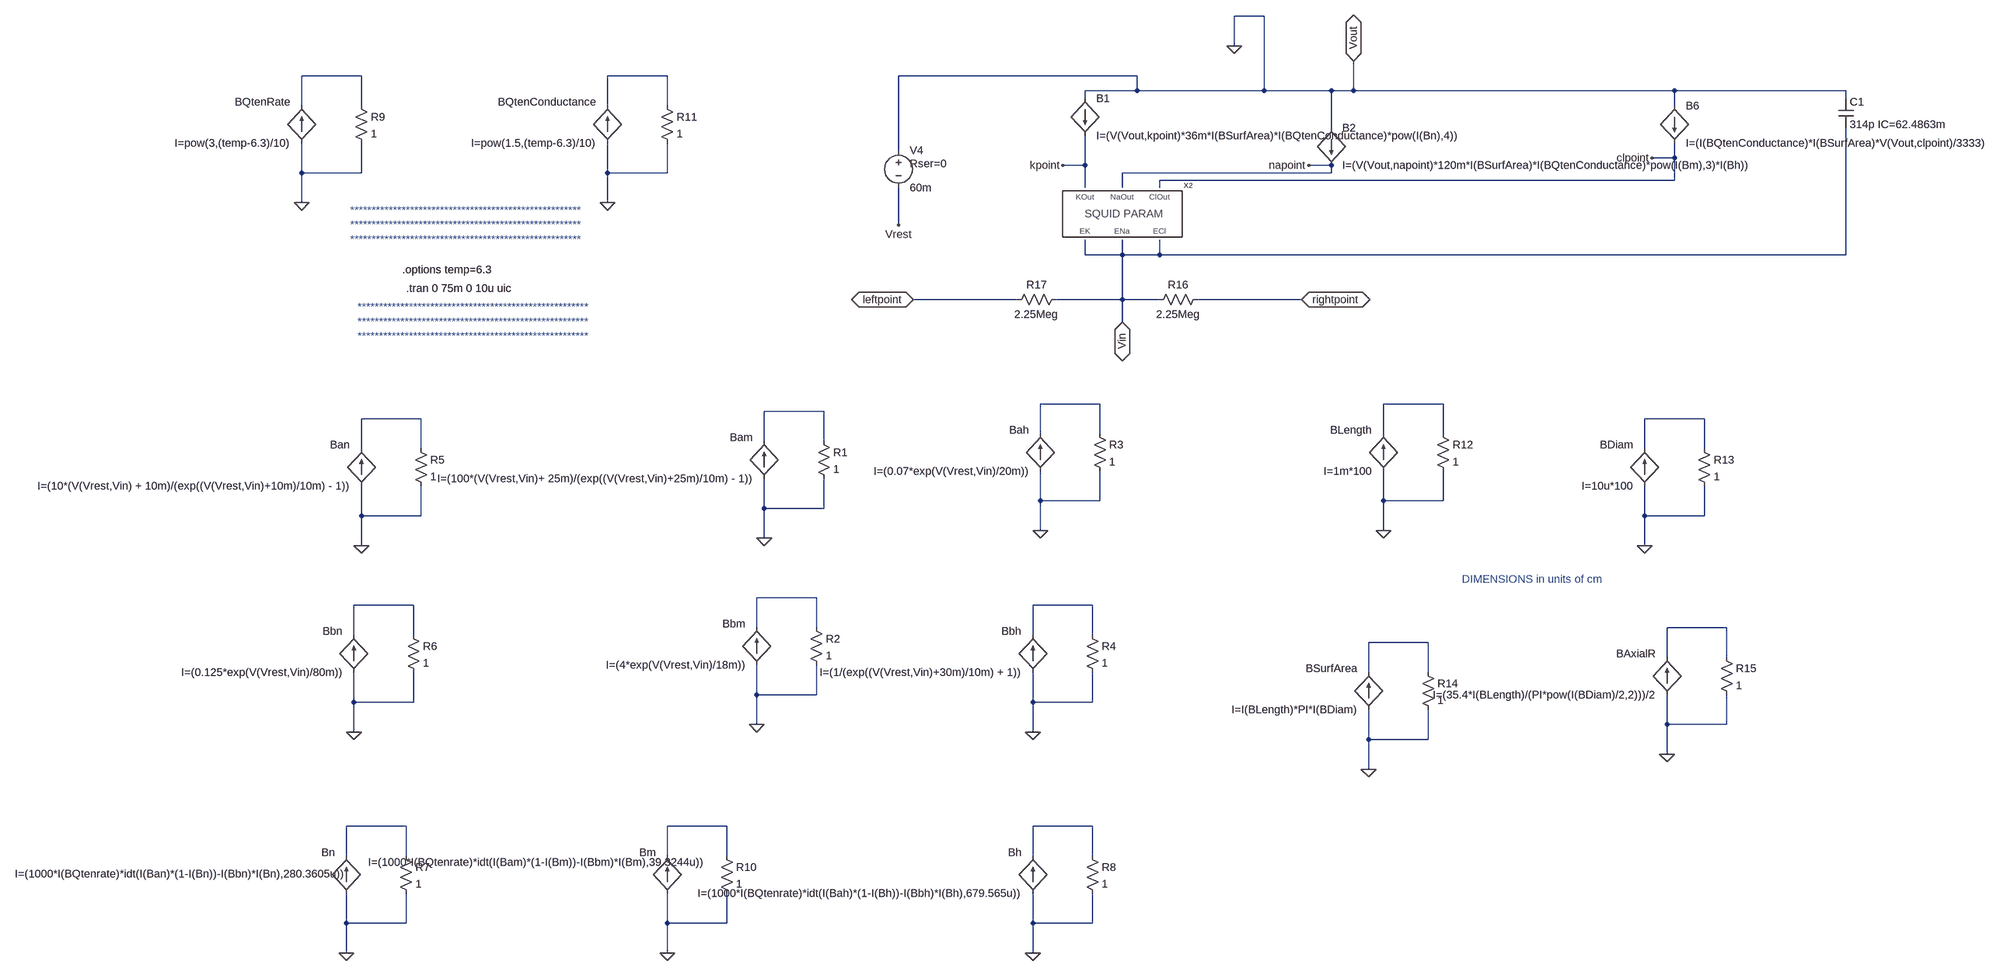
[diagram p0: schematic SqAx10dia1000axial.asc]
SqAx10dia1000axial.asc, the LTspice schematic file:
Version 4
SHEET 1 2616 1348
WIRE 512 -704 448 -704
WIRE 448 -640 448 -704
WIRE -1424 -576 -1552 -576
WIRE -768 -576 -896 -576
WIRE 240 -576 -272 -576
WIRE 240 -544 240 -576
WIRE 240 -544 128 -544
WIRE 512 -544 512 -704
WIRE 512 -544 240 -544
WIRE 656 -544 512 -544
WIRE 704 -544 704 -608
WIRE 704 -544 656 -544
WIRE 1392 -544 704 -544
WIRE 1760 -544 1392 -544
WIRE 128 -528 128 -544
WIRE 1760 -528 1760 -544
WIRE -1552 -512 -1552 -576
WIRE -1424 -512 -1424 -576
WIRE -896 -512 -896 -576
WIRE -768 -512 -768 -576
WIRE 1392 -512 1392 -544
WIRE 656 -464 656 -544
WIRE -272 -416 -272 -576
WIRE 1392 -400 1392 -432
WIRE 1392 -400 1344 -400
WIRE 128 -384 128 -448
WIRE 128 -384 80 -384
WIRE 656 -384 608 -384
WIRE -1552 -368 -1552 -432
WIRE -1424 -368 -1424 -432
WIRE -1424 -368 -1552 -368
WIRE -896 -368 -896 -432
WIRE -768 -368 -768 -432
WIRE -768 -368 -896 -368
WIRE 656 -368 656 -384
WIRE 656 -368 208 -368
WIRE 1392 -352 1392 -400
WIRE 1392 -352 288 -352
WIRE 128 -336 128 -384
WIRE 208 -336 208 -368
WIRE 288 -336 288 -352
WIRE -1552 -304 -1552 -368
WIRE -896 -304 -896 -368
WIRE -272 -256 -272 -336
WIRE 128 -192 128 -224
WIRE 208 -192 208 -224
WIRE 208 -192 128 -192
WIRE 288 -192 288 -224
WIRE 288 -192 208 -192
WIRE 1760 -192 1760 -464
WIRE 1760 -192 288 -192
WIRE -16 -96 -240 -96
WIRE 208 -96 208 -192
WIRE 208 -96 64 -96
WIRE 288 -96 208 -96
WIRE 592 -96 368 -96
WIRE 208 -48 208 -96
WIRE 160 128 32 128
WIRE 896 128 768 128
WIRE -432 144 -560 144
WIRE -1296 160 -1424 160
WIRE 1456 160 1328 160
WIRE 32 192 32 128
WIRE 160 192 160 128
WIRE 768 192 768 128
WIRE 896 192 896 128
WIRE -560 208 -560 144
WIRE -432 208 -432 144
WIRE -1424 224 -1424 160
WIRE -1296 224 -1296 160
WIRE 1328 224 1328 160
WIRE 1456 224 1456 160
WIRE 32 336 32 272
WIRE 160 336 160 272
WIRE 160 336 32 336
WIRE 768 336 768 272
WIRE 896 336 896 272
WIRE 896 336 768 336
WIRE -560 352 -560 288
WIRE -432 352 -432 288
WIRE -432 352 -560 352
WIRE -1424 368 -1424 304
WIRE -1296 368 -1296 304
WIRE -1296 368 -1424 368
WIRE 1328 368 1328 304
WIRE 1456 368 1456 304
WIRE 1456 368 1328 368
WIRE 32 400 32 336
WIRE 768 400 768 336
WIRE -560 416 -560 352
WIRE -1424 432 -1424 368
WIRE 1328 432 1328 368
WIRE -448 544 -576 544
WIRE -1312 560 -1440 560
WIRE 144 560 16 560
WIRE -576 608 -576 544
WIRE -448 608 -448 544
WIRE 1504 608 1376 608
WIRE -1440 624 -1440 560
WIRE -1312 624 -1312 560
WIRE 16 624 16 560
WIRE 144 624 144 560
WIRE 864 640 736 640
WIRE 1376 672 1376 608
WIRE 1504 672 1504 608
WIRE 736 704 736 640
WIRE 864 704 864 640
WIRE -576 752 -576 688
WIRE -448 752 -448 688
WIRE -448 752 -576 752
WIRE -1440 768 -1440 704
WIRE -1312 768 -1312 704
WIRE -1312 768 -1440 768
WIRE 16 768 16 704
WIRE 144 768 144 704
WIRE 144 768 16 768
WIRE -576 816 -576 752
WIRE 1376 816 1376 752
WIRE 1504 816 1504 752
WIRE 1504 816 1376 816
WIRE -1440 832 -1440 768
WIRE 16 832 16 768
WIRE 736 848 736 784
WIRE 864 848 864 784
WIRE 864 848 736 848
WIRE 1376 880 1376 816
WIRE 736 912 736 848
WIRE -1328 1056 -1456 1056
WIRE -640 1056 -768 1056
WIRE 144 1056 16 1056
WIRE -1456 1120 -1456 1056
WIRE -1328 1120 -1328 1056
WIRE -768 1120 -768 1056
WIRE -640 1120 -640 1056
WIRE 16 1120 16 1056
WIRE 144 1120 144 1056
WIRE -1456 1264 -1456 1200
WIRE -1328 1264 -1328 1200
WIRE -1328 1264 -1456 1264
WIRE -768 1264 -768 1200
WIRE -640 1264 -640 1200
WIRE -640 1264 -768 1264
WIRE 16 1264 16 1200
WIRE 144 1264 144 1200
WIRE 144 1264 16 1264
WIRE -1456 1328 -1456 1264
WIRE -768 1328 -768 1264
WIRE 16 1328 16 1264
FLAG 80 -384 kpoint
FLAG 608 -384 napoint
FLAG 1344 -400 clpoint
FLAG 208 -48 Vin
IOPIN 208 -48 BiDir
FLAG 704 -608 Vout
IOPIN 704 -608 BiDir
FLAG -560 416 0
FLAG -576 816 0
FLAG 32 400 0
FLAG 16 832 0
FLAG -1424 432 0
FLAG -1440 832 0
FLAG -272 -256 Vrest
FLAG -1456 1328 0
FLAG 16 1328 0
FLAG -768 1328 0
FLAG -1552 -304 0
FLAG -896 -304 0
FLAG 768 400 0
FLAG 1328 432 0
FLAG 736 912 0
FLAG 1376 880 0
FLAG 592 -96 rightpoint
IOPIN 592 -96 BiDir
FLAG -240 -96 leftpoint
IOPIN -240 -96 BiDir
FLAG 448 -640 0
SYMBOL bi 128 -528 R0
SYMATTR InstName B1
SYMATTR Value I=(V(Vout,kpoint)*36m*I(BSurfArea)*I(BQtenConductance)*pow(I(Bn),4))
SYMBOL bi 656 -464 R0
SYMATTR InstName B2
SYMATTR Value I=(V(Vout,napoint)*120m*I(BSurfArea)*I(BQtenConductance)*pow(I(Bm),3)*I(Bh))
SYMBOL bi -560 288 R180
WINDOW 0 24 88 Left 0
WINDOW 3 24 0 Left 0
SYMATTR InstName Bam
SYMATTR Value I=(100*(V(Vrest,Vin)+ 25m)/(exp((V(Vrest,Vin)+25m)/10m) - 1))
SYMBOL res -448 192 R0
SYMATTR InstName R1
SYMATTR Value 1
SYMBOL bi -576 688 R180
WINDOW 0 24 88 Left 0
WINDOW 3 24 0 Left 0
SYMATTR InstName Bbm
SYMATTR Value I=(4*exp(V(Vrest,Vin)/18m))
SYMBOL res -464 592 R0
SYMATTR InstName R2
SYMATTR Value 1
SYMBOL bi 32 272 R180
WINDOW 0 24 88 Left 0
WINDOW 3 24 0 Left 0
SYMATTR InstName Bah
SYMATTR Value I=(0.07*exp(V(Vrest,Vin)/20m))
SYMBOL res 144 176 R0
SYMATTR InstName R3
SYMATTR Value 1
SYMBOL bi 16 704 R180
WINDOW 0 24 88 Left 0
WINDOW 3 24 0 Left 0
SYMATTR InstName Bbh
SYMATTR Value I=(1/(exp((V(Vrest,Vin)+30m)/10m) + 1))
SYMBOL res 128 608 R0
SYMATTR InstName R4
SYMATTR Value 1
SYMBOL bi -1424 304 R180
WINDOW 0 24 88 Left 0
WINDOW 3 24 0 Left 0
SYMATTR InstName Ban
SYMATTR Value I=(10*(V(Vrest,Vin) + 10m)/(exp((V(Vrest,Vin)+10m)/10m) - 1))
SYMBOL res -1312 208 R0
SYMATTR InstName R5
SYMATTR Value 1
SYMBOL bi -1440 704 R180
WINDOW 0 24 88 Left 0
WINDOW 3 24 0 Left 0
SYMATTR InstName Bbn
SYMATTR Value I=(0.125*exp(V(Vrest,Vin)/80m))
SYMBOL res -1328 608 R0
SYMATTR InstName R6
SYMATTR Value 1
SYMBOL voltage -272 -432 R0
WINDOW 123 0 0 Left 0
WINDOW 39 24 44 Left 0
SYMATTR SpiceLine Rser=0
SYMATTR InstName V4
SYMATTR Value 60m
SYMBOL bi -1456 1200 R180
WINDOW 0 24 88 Left 0
WINDOW 3 3 42 Left 0
SYMATTR InstName Bn
SYMATTR Value I=(1000*I(BQtenrate)*idt(I(Ban)*(1-I(Bn))-I(Bbn)*I(Bn),280.3605u))
SYMBOL res -1344 1104 R0
SYMATTR InstName R7
SYMATTR Value 1
SYMBOL bi 16 1200 R180
WINDOW 0 24 88 Left 0
WINDOW 3 24 0 Left 0
SYMATTR InstName Bh
SYMATTR Value I=(1000*I(BQtenrate)*idt(I(Bah)*(1-I(Bh))-I(Bbh)*I(Bh),679.565u))
SYMBOL res 128 1104 R0
SYMATTR InstName R8
SYMATTR Value 1
SYMBOL bi -768 1200 R180
WINDOW 0 24 88 Left 0
WINDOW 3 -80 67 Left 0
SYMATTR InstName Bm
SYMATTR Value I=(1000*I(BQtenrate)*idt(I(Bam)*(1-I(Bm))-I(Bbm)*I(Bm),39.3244u))
SYMBOL res -656 1104 R0
SYMATTR InstName R10
SYMATTR Value 1
SYMBOL cap 1744 -528 R0
SYMATTR InstName C1
SYMATTR Value 314p IC=62.4863m
SYMBOL bi 1392 -512 R0
SYMATTR InstName B6
SYMATTR Value I=(I(BQtenConductance)*I(BSurfArea)*V(Vout,clpoint)/3333)
SYMBOL bi -1552 -432 R180
WINDOW 0 24 88 Left 0
WINDOW 3 24 0 Left 0
SYMATTR InstName BQtenRate
SYMATTR Value I=pow(3,(temp-6.3)/10)
SYMBOL res -1440 -528 R0
SYMATTR InstName R9
SYMATTR Value 1
SYMBOL bi -896 -432 R180
WINDOW 0 24 88 Left 0
WINDOW 3 24 0 Left 0
SYMATTR InstName BQtenConductance
SYMATTR Value I=pow(1.5,(temp-6.3)/10)
SYMBOL res -784 -528 R0
SYMATTR InstName R11
SYMATTR Value 1
SYMBOL bi 768 272 R180
WINDOW 0 24 88 Left 0
WINDOW 3 24 0 Left 0
SYMATTR InstName BLength
SYMATTR Value I=1m*100
SYMBOL res 880 176 R0
SYMATTR InstName R12
SYMATTR Value 1
SYMBOL bi 1328 304 R180
WINDOW 0 24 88 Left 0
WINDOW 3 24 0 Left 0
SYMATTR InstName BDiam
SYMATTR Value I=10u*100
SYMBOL res 1440 208 R0
SYMATTR InstName R13
SYMATTR Value 1
SYMBOL bi 736 784 R180
WINDOW 0 24 88 Left 0
WINDOW 3 24 0 Left 0
SYMATTR InstName BSurfArea
SYMATTR Value I=I(BLength)*PI*I(BDiam)
SYMBOL res 848 688 R0
SYMATTR InstName R14
SYMATTR Value 1
SYMBOL bi 1376 752 R180
WINDOW 0 24 88 Left 0
WINDOW 3 24 0 Left 0
SYMATTR InstName BAxialR
SYMATTR Value I=(35.4*I(BLength)/(PI*pow(I(BDiam)/2,2)))/2
SYMBOL res 1488 656 R0
SYMATTR InstName R15
SYMATTR Value 1
SYMBOL res 384 -112 R90
WINDOW 0 0 56 VBottom 0
WINDOW 3 32 56 VTop 0
SYMATTR InstName R16
SYMATTR Value 2.25Meg
SYMBOL res 80 -112 R90
WINDOW 0 0 56 VBottom 0
WINDOW 3 32 56 VTop 0
SYMATTR InstName R17
SYMATTR Value 2.25Meg
SYMBOL SquidNernstParameterized 208 -272 R0
SYMATTR InstName X2
TEXT -1328 -120 Left 0 !.tran 0 75m 0 10u uic
TEXT -1336 -160 Left 0 !.options temp=6.3
TEXT 936 504 Left 0 ;DIMENSIONS in units of cm
TEXT -1432 -80 Left 0 ;******************************************************\n******************************************************\n******************************************************
TEXT -1448 -288 Left 0 ;******************************************************\n******************************************************\n******************************************************

The netlist it stands for:
* SqAx10dia1000axial.asc
B1 0 kpoint I=(V(Vout,kpoint)*36m*I(BSurfArea)*I(BQtenConductance)*pow(I(Bn),4))
B2 0 napoint I=(V(Vout,napoint)*120m*I(BSurfArea)*I(BQtenConductance)*pow(I(Bm),3)*I(Bh))
Bam 0 N005 I=(100*(V(Vrest,Vin)+ 25m)/(exp((V(Vrest,Vin)+25m)/10m) - 1))
R1 N005 0 1
Bbm 0 N008 I=(4*exp(V(Vrest,Vin)/18m))
R2 N008 0 1
Bah 0 N003 I=(0.07*exp(V(Vrest,Vin)/20m))
R3 N003 0 1
Bbh 0 N010 I=(1/(exp((V(Vrest,Vin)+30m)/10m) + 1))
R4 N010 0 1
Ban 0 N006 I=(10*(V(Vrest,Vin) + 10m)/(exp((V(Vrest,Vin)+10m)/10m) - 1))
R5 N006 0 1
Bbn 0 N009 I=(0.125*exp(V(Vrest,Vin)/80m))
R6 N009 0 1
V4 0 Vrest 60m Rser=0
Bn 0 N013 I=(1000*I(BQtenrate)*idt(I(Ban)*(1-I(Bn))-I(Bbn)*I(Bn),280.3605u))
R7 N013 0 1
Bh 0 N015 I=(1000*I(BQtenrate)*idt(I(Bah)*(1-I(Bh))-I(Bbh)*I(Bh),679.565u))
R8 N015 0 1
Bm 0 N014 I=(1000*I(BQtenrate)*idt(I(Bam)*(1-I(Bm))-I(Bbm)*I(Bm),39.3244u))
R10 N014 0 1
C1 0 Vin 314p IC=62.4863m
B6 0 clpoint I=(I(BQtenConductance)*I(BSurfArea)*V(Vout,clpoint)/3333)
BQtenRate 0 N001 I=pow(3,(temp-6.3)/10)
R9 N001 0 1
BQtenConductance 0 N002 I=pow(1.5,(temp-6.3)/10)
R11 N002 0 1
BLength 0 N004 I=1m*100
R12 N004 0 1
BDiam 0 N007 I=10u*100
R13 N007 0 1
BSurfArea 0 N012 I=I(BLength)*PI*I(BDiam)
R14 N012 0 1
BAxialR 0 N011 I=(35.4*I(BLength)/(PI*pow(I(BDiam)/2,2)))/2
R15 N011 0 1
R16 rightpoint Vin 2.25Meg
R17 Vin leftpoint 2.25Meg
XX2 Vin Vin Vin kpoint clpoint napoint SquidNernstParameterized  ; pins EK ECl ENa KOut ClOut NaOut
.tran 0 75m 0 10u uic
.options temp=6.3
* DIMENSIONS in units of cm
* ******************************************************
* ******************************************************
* ******************************************************
* ******************************************************
* ******************************************************
* ******************************************************
.backanno
.end